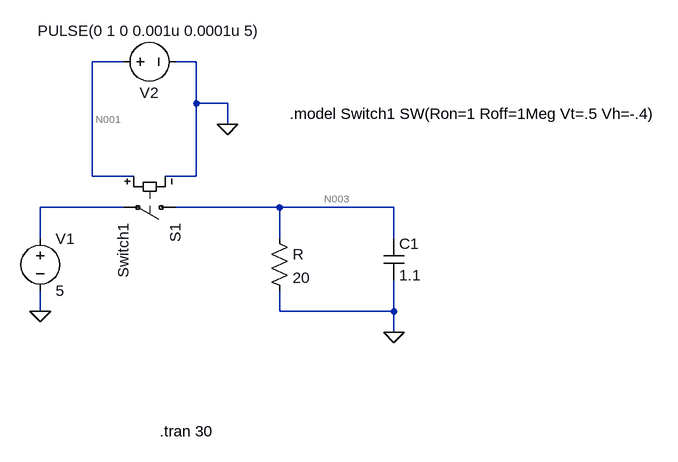
[diagram p0: schematic Draft1.asc]
Draft1.asc, the LTspice schematic file:
Version 4
SHEET 1 880 680
WIRE -48 -416 -96 -416
WIRE 64 -416 32 -416
WIRE 64 -352 64 -416
WIRE 112 -352 64 -352
WIRE 112 -320 112 -352
WIRE -96 -240 -96 -416
WIRE -32 -240 -96 -240
WIRE 64 -240 64 -352
WIRE 64 -240 16 -240
WIRE -48 -192 -176 -192
WIRE 192 -192 32 -192
WIRE 368 -192 192 -192
WIRE -176 -144 -176 -192
WIRE 192 -144 192 -192
WIRE 368 -144 368 -192
WIRE -176 -32 -176 -64
WIRE 192 -32 192 -64
WIRE 368 -32 368 -80
WIRE 368 -32 192 -32
WIRE 368 0 368 -32
FLAG 368 0 0
FLAG -176 -32 0
FLAG 112 -320 0
SYMBOL res 176 -160 R0
SYMATTR InstName R
SYMATTR Value 20
SYMBOL cap 352 -144 R0
SYMATTR InstName C1
SYMATTR Value 1.1
SYMBOL voltage -176 -160 R0
SYMATTR InstName V1
SYMATTR Value 5
SYMBOL sw 48 -192 R90
SYMATTR InstName S1
SYMATTR Value Switch1
SYMBOL voltage -64 -416 R270
WINDOW 0 -32 56 VBottom 2
WINDOW 3 32 56 VTop 2
WINDOW 123 0 0 Left 0
WINDOW 39 0 0 Left 0
SYMATTR InstName V2
SYMATTR Value PULSE(0 1 0 0.001u 0.0001u 5)
TEXT 8 152 Left 2 !.tran 30
TEXT 208 -336 Left 2 !.model Switch1 SW(Ron=1 Roff=1Meg Vt=.5 Vh=-.4)

The netlist it stands for:
* Draft1.asc
R N003 0 20
C1 N003 0 1.1
V1 N002 0 5
S1 N003 N002 N001 0 Switch1
V2 N001 0 PULSE(0 1 0 0.001u 0.0001u 5)
.tran 30
.model Switch1 SW(Ron=1 Roff=1Meg Vt=.5 Vh=-.4)
.backanno
.end

* Results of the author's LTspice run, read from the files saved beside the schematic
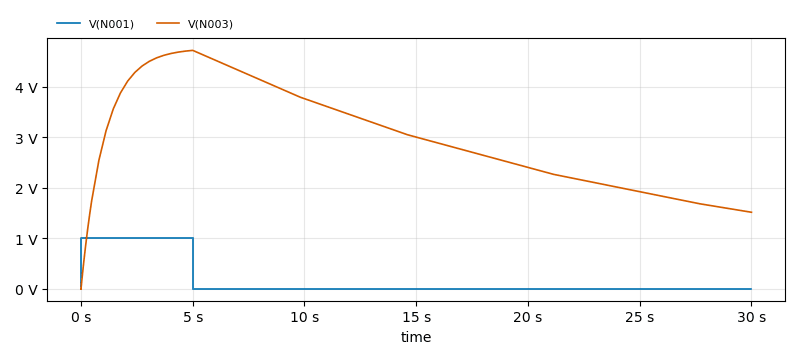
[diagram p1: Transient Analysis of Draft1.asc, plotted from the saved traces]
* Transient Analysis, 1 run:
*   V(N001): min 0 V, max 1 V, average 166.7 mV, rms 408.2 mV, last 0 V
*   V(N003): min 100 µV, max 4.722 V, average 2.991 V, rms 3.175 V, last 1.516 V